# Altium project MiniPC MB GOST.PrjPcb (part 25 of 31)
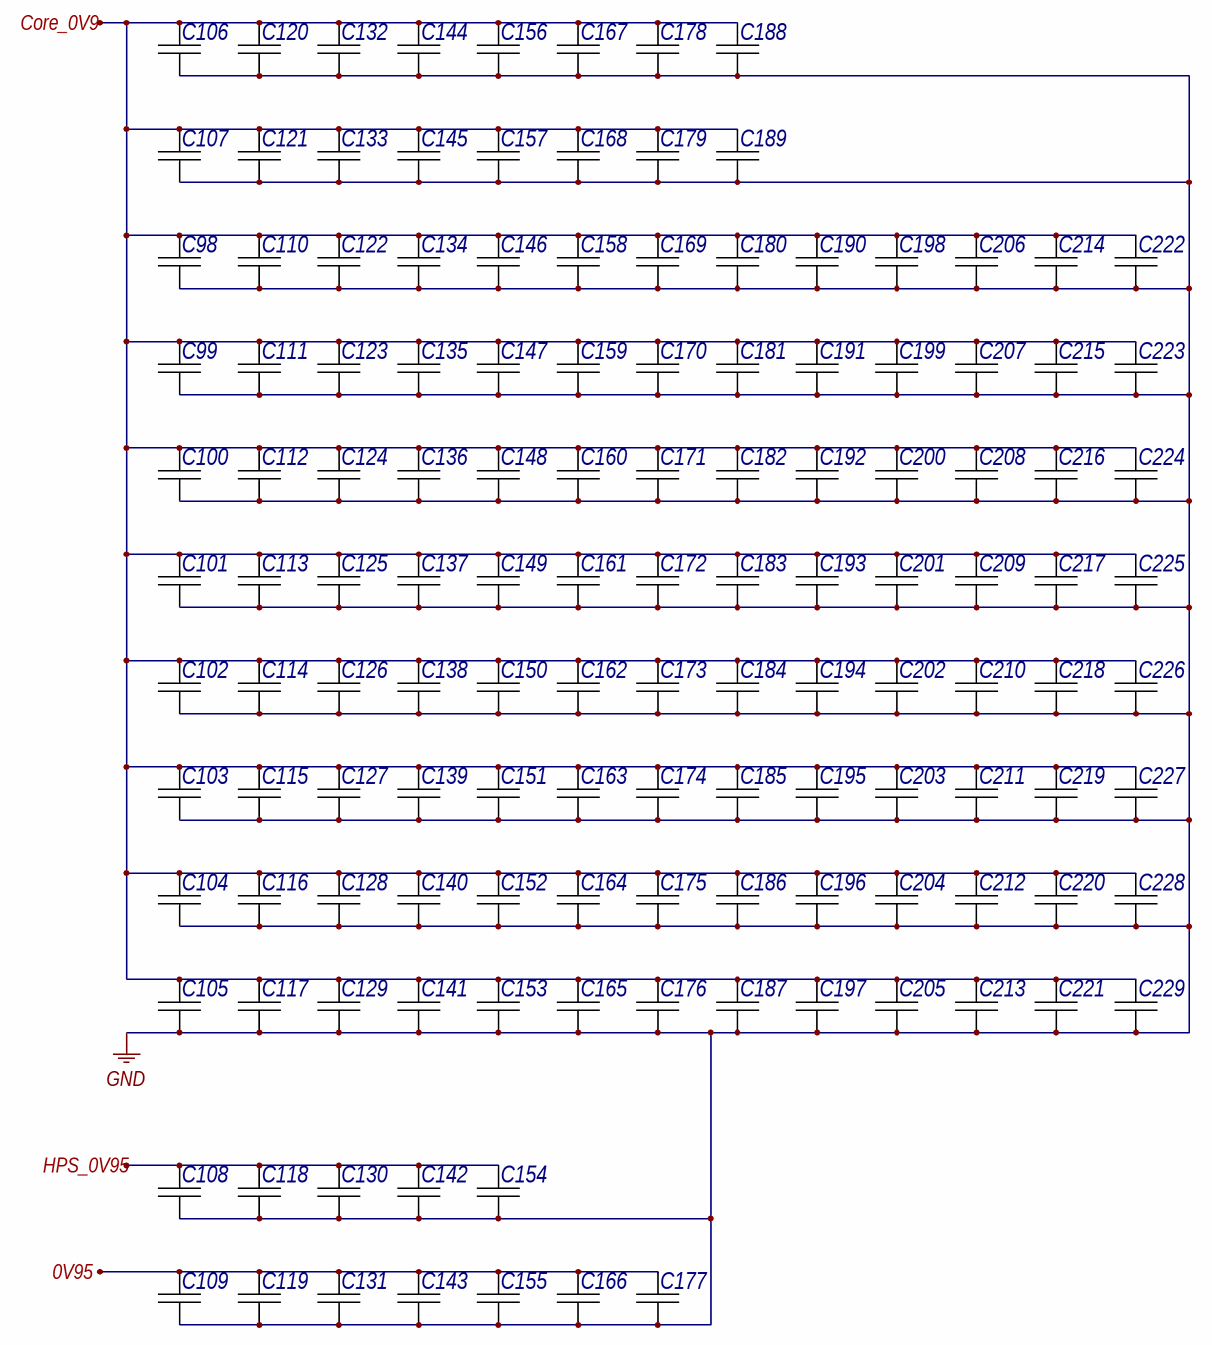
[diagram p52: Core Supply Filter.SchDoc]

## Sheet Core Supply Filter.SchDoc (continued)

### Library data of the parts (continued)
C144 = E14: Chip Capacitor, 100 uF, +/- 20%, 6.3 V, -55 to 85 degC, 1206 (3216 Metric), RoHS, Tape and Reel; Тип элемента: Конденсатор; Capacitance: 100 uF; Case\/Package: 1206; Type (Capacitors): X5R; Voltage Rating: 6.3 V; Old_des: C135; New_des: C136; UID: E14; Component Kind: Standard; Case Code (Imperial): 1206; Case Code (Metric): 3216; ComponentLink1Description: Manufacturer URL; ComponentLink1URL: http://www.murata.com/; ComponentLink2Description: Datasheet; ComponentLink2URL: http://psearch.en.murata.com/capacitor/product/GRM31CR60J107ME39%23.pdf; DatasheetVersion: 09/2016; Length: 3.2 mm; Max Operating Temperature: 85 degC; Min Operating Temperature: -55 degC; Mounting Technology: Surface Mount; Package Quantity: 2000; PackageDescription: 2-Pin Surface Mount Device, Body 3.2 x 1.6 mm; Packaging: Tape and Reel; PartNumber: GRM31CR60J107ME39L; RoHSCompliant: true; Tolerance: 20%; Width: 1.6 mm; Height: 1.6 mm; Mount: Surface Mount; PackageReference: 1206; Pins: 2; Radiation Hardening: No; REACH SVHC: No SVHC; Voltage Rating (DC): 6.3 V
C145 = E14: Chip Capacitor, 100 uF, +/- 20%, 6.3 V, -55 to 85 degC, 1206 (3216 Metric), RoHS, Tape and Reel; Тип элемента: Конденсатор; Capacitance: 100 uF; Case\/Package: 1206; Type (Capacitors): X5R; Voltage Rating: 6.3 V; Old_des: C148; New_des: C137; UID: E14; Component Kind: Standard; Case Code (Imperial): 1206; Case Code (Metric): 3216; ComponentLink1Description: Manufacturer URL; ComponentLink1URL: http://www.murata.com/; ComponentLink2Description: Datasheet; ComponentLink2URL: http://psearch.en.murata.com/capacitor/product/GRM31CR60J107ME39%23.pdf; DatasheetVersion: 09/2016; Length: 3.2 mm; Max Operating Temperature: 85 degC; Min Operating Temperature: -55 degC; Mounting Technology: Surface Mount; Package Quantity: 2000; PackageDescription: 2-Pin Surface Mount Device, Body 3.2 x 1.6 mm; Packaging: Tape and Reel; PartNumber: GRM31CR60J107ME39L; RoHSCompliant: true; Tolerance: 20%; Width: 1.6 mm; Height: 1.6 mm; Mount: Surface Mount; PackageReference: 1206; Pins: 2; Radiation Hardening: No; REACH SVHC: No SVHC; Voltage Rating (DC): 6.3 V
C146 = E22: Chip Capacitor, 100 nF, +/- 10%, 6.3 V, -55 to 85 degC, 0201 (0603 Metric), RoHS, Tape and Reel; Manufacturer: Basic Passives; Тип элемента: Конденсатор; Capacitance: 100 nF; Case\/Package: 0201; Type (Capacitors): X5R; Voltage Rating: 6.3 V; Voltage Rating (DC): 3 V; Old_des: C192; UID: E22; Component Kind: Standard; Case Code (Imperial): 0201; Case Code (Metric): 0603; ComponentLink1Description: Manufacturer URL; ComponentLink1URL: http://www.murata.com/; ComponentLink2Description: Datasheet; ComponentLink2URL: http://search.murata.co.jp/Ceramy/image/img/A01X/G101/ENG/GRM033R60J104KE19-01.pdf; DatasheetVersion: 03/2016; Length: 0.6 mm; Max Operating Temperature: 85 degC; Min Operating Temperature: -55 degC; Mounting Technology: Surface Mount; Package Quantity: 15000; PackageDescription: 2-Pin Surface Mount Device, Body 0.6 x 0.3 mm; Packaging: Tape and Reel; PartNumber: GRM033R60J104KE19D; RoHSCompliant: true; Tolerance: 10%; Width: 0.3 mm; Height: 0.3 mm; Mount: Surface Mount; PackageReference: 0201; Pins: 2; Radiation Hardening: No; REACH SVHC: No SVHC
C147 = E22: Chip Capacitor, 100 nF, +/- 10%, 6.3 V, -55 to 85 degC, 0201 (0603 Metric), RoHS, Tape and Reel; Manufacturer: Basic Passives; Тип элемента: Конденсатор; Capacitance: 100 nF; Case\/Package: 0201; Type (Capacitors): X5R; Voltage Rating: 6.3 V; Voltage Rating (DC): 3 V; Old_des: C193; UID: E22; Component Kind: Standard; Case Code (Imperial): 0201; Case Code (Metric): 0603; ComponentLink1Description: Manufacturer URL; ComponentLink1URL: http://www.murata.com/; ComponentLink2Description: Datasheet; ComponentLink2URL: http://search.murata.co.jp/Ceramy/image/img/A01X/G101/ENG/GRM033R60J104KE19-01.pdf; DatasheetVersion: 03/2016; Length: 0.6 mm; Max Operating Temperature: 85 degC; Min Operating Temperature: -55 degC; Mounting Technology: Surface Mount; Package Quantity: 15000; PackageDescription: 2-Pin Surface Mount Device, Body 0.6 x 0.3 mm; Packaging: Tape and Reel; PartNumber: GRM033R60J104KE19D; RoHSCompliant: true; Tolerance: 10%; Width: 0.3 mm; Height: 0.3 mm; Mount: Surface Mount; PackageReference: 0201; Pins: 2; Radiation Hardening: No; REACH SVHC: No SVHC
C148 = E22: Chip Capacitor, 100 nF, +/- 10%, 6.3 V, -55 to 85 degC, 0201 (0603 Metric), RoHS, Tape and Reel; Manufacturer: Basic Passives; Тип элемента: Конденсатор; Capacitance: 100 nF; Case\/Package: 0201; Type (Capacitors): X5R; Voltage Rating: 6.3 V; Voltage Rating (DC): 3 V; Old_des: C194; UID: E22; Component Kind: Standard; Case Code (Imperial): 0201; Case Code (Metric): 0603; ComponentLink1Description: Manufacturer URL; ComponentLink1URL: http://www.murata.com/; ComponentLink2Description: Datasheet; ComponentLink2URL: http://search.murata.co.jp/Ceramy/image/img/A01X/G101/ENG/GRM033R60J104KE19-01.pdf; DatasheetVersion: 03/2016; Length: 0.6 mm; Max Operating Temperature: 85 degC; Min Operating Temperature: -55 degC; Mounting Technology: Surface Mount; Package Quantity: 15000; PackageDescription: 2-Pin Surface Mount Device, Body 0.6 x 0.3 mm; Packaging: Tape and Reel; PartNumber: GRM033R60J104KE19D; RoHSCompliant: true; Tolerance: 10%; Width: 0.3 mm; Height: 0.3 mm; Mount: Surface Mount; PackageReference: 0201; Pins: 2; Radiation Hardening: No; REACH SVHC: No SVHC
C149 = E22: Chip Capacitor, 100 nF, +/- 10%, 6.3 V, -55 to 85 degC, 0201 (0603 Metric), RoHS, Tape and Reel; Manufacturer: Basic Passives; Тип элемента: Конденсатор; Capacitance: 100 nF; Case\/Package: 0201; Type (Capacitors): X5R; Voltage Rating: 6.3 V; Voltage Rating (DC): 3 V; Old_des: C195; UID: E22; Component Kind: Standard; Case Code (Imperial): 0201; Case Code (Metric): 0603; ComponentLink1Description: Manufacturer URL; ComponentLink1URL: http://www.murata.com/; ComponentLink2Description: Datasheet; ComponentLink2URL: http://search.murata.co.jp/Ceramy/image/img/A01X/G101/ENG/GRM033R60J104KE19-01.pdf; DatasheetVersion: 03/2016; Length: 0.6 mm; Max Operating Temperature: 85 degC; Min Operating Temperature: -55 degC; Mounting Technology: Surface Mount; Package Quantity: 15000; PackageDescription: 2-Pin Surface Mount Device, Body 0.6 x 0.3 mm; Packaging: Tape and Reel; PartNumber: GRM033R60J104KE19D; RoHSCompliant: true; Tolerance: 10%; Width: 0.3 mm; Height: 0.3 mm; Mount: Surface Mount; PackageReference: 0201; Pins: 2; Radiation Hardening: No; REACH SVHC: No SVHC
C150 = E22: Chip Capacitor, 100 nF, +/- 10%, 6.3 V, -55 to 85 degC, 0201 (0603 Metric), RoHS, Tape and Reel; Manufacturer: Basic Passives; Тип элемента: Конденсатор; Capacitance: 100 nF; Case\/Package: 0201; Type (Capacitors): X5R; Voltage Rating: 6.3 V; Voltage Rating (DC): 3 V; Old_des: C196; UID: E22; Component Kind: Standard; Case Code (Imperial): 0201; Case Code (Metric): 0603; ComponentLink1Description: Manufacturer URL; ComponentLink1URL: http://www.murata.com/; ComponentLink2Description: Datasheet; ComponentLink2URL: http://search.murata.co.jp/Ceramy/image/img/A01X/G101/ENG/GRM033R60J104KE19-01.pdf; DatasheetVersion: 03/2016; Length: 0.6 mm; Max Operating Temperature: 85 degC; Min Operating Temperature: -55 degC; Mounting Technology: Surface Mount; Package Quantity: 15000; PackageDescription: 2-Pin Surface Mount Device, Body 0.6 x 0.3 mm; Packaging: Tape and Reel; PartNumber: GRM033R60J104KE19D; RoHSCompliant: true; Tolerance: 10%; Width: 0.3 mm; Height: 0.3 mm; Mount: Surface Mount; PackageReference: 0201; Pins: 2; Radiation Hardening: No; REACH SVHC: No SVHC
C151 = E22: Chip Capacitor, 100 nF, +/- 10%, 6.3 V, -55 to 85 degC, 0201 (0603 Metric), RoHS, Tape and Reel; Manufacturer: Basic Passives; Тип элемента: Конденсатор; Capacitance: 100 nF; Case\/Package: 0201; Type (Capacitors): X5R; Voltage Rating: 6.3 V; Voltage Rating (DC): 3 V; Old_des: C197; UID: E22; Component Kind: Standard; Case Code (Imperial): 0201; Case Code (Metric): 0603; ComponentLink1Description: Manufacturer URL; ComponentLink1URL: http://www.murata.com/; ComponentLink2Description: Datasheet; ComponentLink2URL: http://search.murata.co.jp/Ceramy/image/img/A01X/G101/ENG/GRM033R60J104KE19-01.pdf; DatasheetVersion: 03/2016; Length: 0.6 mm; Max Operating Temperature: 85 degC; Min Operating Temperature: -55 degC; Mounting Technology: Surface Mount; Package Quantity: 15000; PackageDescription: 2-Pin Surface Mount Device, Body 0.6 x 0.3 mm; Packaging: Tape and Reel; PartNumber: GRM033R60J104KE19D; RoHSCompliant: true; Tolerance: 10%; Width: 0.3 mm; Height: 0.3 mm; Mount: Surface Mount; PackageReference: 0201; Pins: 2; Radiation Hardening: No; REACH SVHC: No SVHC
C152 = E22: Chip Capacitor, 100 nF, +/- 10%, 6.3 V, -55 to 85 degC, 0201 (0603 Metric), RoHS, Tape and Reel; Manufacturer: Basic Passives; Тип элемента: Конденсатор; Capacitance: 100 nF; Case\/Package: 0201; Type (Capacitors): X5R; Voltage Rating: 6.3 V; Voltage Rating (DC): 3 V; Old_des: C198; UID: E22; Component Kind: Standard; Case Code (Imperial): 0201; Case Code (Metric): 0603; ComponentLink1Description: Manufacturer URL; ComponentLink1URL: http://www.murata.com/; ComponentLink2Description: Datasheet; ComponentLink2URL: http://search.murata.co.jp/Ceramy/image/img/A01X/G101/ENG/GRM033R60J104KE19-01.pdf; DatasheetVersion: 03/2016; Length: 0.6 mm; Max Operating Temperature: 85 degC; Min Operating Temperature: -55 degC; Mounting Technology: Surface Mount; Package Quantity: 15000; PackageDescription: 2-Pin Surface Mount Device, Body 0.6 x 0.3 mm; Packaging: Tape and Reel; PartNumber: GRM033R60J104KE19D; RoHSCompliant: true; Tolerance: 10%; Width: 0.3 mm; Height: 0.3 mm; Mount: Surface Mount; PackageReference: 0201; Pins: 2; Radiation Hardening: No; REACH SVHC: No SVHC
C153 = E22: Chip Capacitor, 100 nF, +/- 10%, 6.3 V, -55 to 85 degC, 0201 (0603 Metric), RoHS, Tape and Reel; Manufacturer: Basic Passives; Тип элемента: Конденсатор; Capacitance: 100 nF; Case\/Package: 0201; Type (Capacitors): X5R; Voltage Rating: 6.3 V; Voltage Rating (DC): 3 V; Old_des: C199; UID: E22; Component Kind: Standard; Case Code (Imperial): 0201; Case Code (Metric): 0603; ComponentLink1Description: Manufacturer URL; ComponentLink1URL: http://www.murata.com/; ComponentLink2Description: Datasheet; ComponentLink2URL: http://search.murata.co.jp/Ceramy/image/img/A01X/G101/ENG/GRM033R60J104KE19-01.pdf; DatasheetVersion: 03/2016; Length: 0.6 mm; Max Operating Temperature: 85 degC; Min Operating Temperature: -55 degC; Mounting Technology: Surface Mount; Package Quantity: 15000; PackageDescription: 2-Pin Surface Mount Device, Body 0.6 x 0.3 mm; Packaging: Tape and Reel; PartNumber: GRM033R60J104KE19D; RoHSCompliant: true; Tolerance: 10%; Width: 0.3 mm; Height: 0.3 mm; Mount: Surface Mount; PackageReference: 0201; Pins: 2; Radiation Hardening: No; REACH SVHC: No SVHC
C154 = E22: Chip Capacitor, 100 nF, +/- 10%, 6.3 V, -55 to 85 degC, 0201 (0603 Metric), RoHS, Tape and Reel; Manufacturer: Basic Passives; Тип элемента: Конденсатор; Capacitance: 100 nF; Case\/Package: 0201; Type (Capacitors): X5R; Voltage Rating: 6.3 V; Voltage Rating (DC): 3 V; Old_des: C146; UID: E22; Component Kind: Standard; Case Code (Imperial): 0201; Case Code (Metric): 0603; ComponentLink1Description: Manufacturer URL; ComponentLink1URL: http://www.murata.com/; ComponentLink2Description: Datasheet; ComponentLink2URL: http://search.murata.co.jp/Ceramy/image/img/A01X/G101/ENG/GRM033R60J104KE19-01.pdf; DatasheetVersion: 03/2016; Length: 0.6 mm; Max Operating Temperature: 85 degC; Min Operating Temperature: -55 degC; Mounting Technology: Surface Mount; Package Quantity: 15000; PackageDescription: 2-Pin Surface Mount Device, Body 0.6 x 0.3 mm; Packaging: Tape and Reel; PartNumber: GRM033R60J104KE19D; RoHSCompliant: true; Tolerance: 10%; Width: 0.3 mm; Height: 0.3 mm; Mount: Surface Mount; PackageReference: 0201; Pins: 2; Radiation Hardening: No; REACH SVHC: No SVHC
C155 = E22: Chip Capacitor, 100 nF, +/- 10%, 6.3 V, -55 to 85 degC, 0201 (0603 Metric), RoHS, Tape and Reel; Manufacturer: Basic Passives; Тип элемента: Конденсатор; Capacitance: 100 nF; Case\/Package: 0201; Type (Capacitors): X5R; Voltage Rating: 6.3 V; Voltage Rating (DC): 3 V; Old_des: C165; UID: E22; Component Kind: Standard; Case Code (Imperial): 0201; Case Code (Metric): 0603; ComponentLink1Description: Manufacturer URL; ComponentLink1URL: http://www.murata.com/; ComponentLink2Description: Datasheet; ComponentLink2URL: http://search.murata.co.jp/Ceramy/image/img/A01X/G101/ENG/GRM033R60J104KE19-01.pdf; DatasheetVersion: 03/2016; Length: 0.6 mm; Max Operating Temperature: 85 degC; Min Operating Temperature: -55 degC; Mounting Technology: Surface Mount; Package Quantity: 15000; PackageDescription: 2-Pin Surface Mount Device, Body 0.6 x 0.3 mm; Packaging: Tape and Reel; PartNumber: GRM033R60J104KE19D; RoHSCompliant: true; Tolerance: 10%; Width: 0.3 mm; Height: 0.3 mm; Mount: Surface Mount; PackageReference: 0201; Pins: 2; Radiation Hardening: No; REACH SVHC: No SVHC
C156 = E14: Chip Capacitor, 100 uF, +/- 20%, 6.3 V, -55 to 85 degC, 1206 (3216 Metric), RoHS, Tape and Reel; Тип элемента: Конденсатор; Capacitance: 100 uF; Case\/Package: 1206; Type (Capacitors): X5R; Voltage Rating: 6.3 V; Old_des: C136; New_des: C148; UID: E14; Component Kind: Standard; Case Code (Imperial): 1206; Case Code (Metric): 3216; ComponentLink1Description: Manufacturer URL; ComponentLink1URL: http://www.murata.com/; ComponentLink2Description: Datasheet; ComponentLink2URL: http://psearch.en.murata.com/capacitor/product/GRM31CR60J107ME39%23.pdf; DatasheetVersion: 09/2016; Length: 3.2 mm; Max Operating Temperature: 85 degC; Min Operating Temperature: -55 degC; Mounting Technology: Surface Mount; Package Quantity: 2000; PackageDescription: 2-Pin Surface Mount Device, Body 3.2 x 1.6 mm; Packaging: Tape and Reel; PartNumber: GRM31CR60J107ME39L; RoHSCompliant: true; Tolerance: 20%; Width: 1.6 mm; Height: 1.6 mm; Mount: Surface Mount; PackageReference: 1206; Pins: 2; Radiation Hardening: No; REACH SVHC: No SVHC; Voltage Rating (DC): 6.3 V
C157 = E14: Chip Capacitor, 100 uF, +/- 20%, 6.3 V, -55 to 85 degC, 1206 (3216 Metric), RoHS, Tape and Reel; Тип элемента: Конденсатор; Capacitance: 100 uF; Case\/Package: 1206; Type (Capacitors): X5R; Voltage Rating: 6.3 V; Old_des: C149; UID: E14; Component Kind: Standard; Case Code (Imperial): 1206; Case Code (Metric): 3216; ComponentLink1Description: Manufacturer URL; ComponentLink1URL: http://www.murata.com/; ComponentLink2Description: Datasheet; ComponentLink2URL: http://psearch.en.murata.com/capacitor/product/GRM31CR60J107ME39%23.pdf; DatasheetVersion: 09/2016; Length: 3.2 mm; Max Operating Temperature: 85 degC; Min Operating Temperature: -55 degC; Mounting Technology: Surface Mount; Package Quantity: 2000; PackageDescription: 2-Pin Surface Mount Device, Body 3.2 x 1.6 mm; Packaging: Tape and Reel; PartNumber: GRM31CR60J107ME39L; RoHSCompliant: true; Tolerance: 20%; Width: 1.6 mm; Height: 1.6 mm; Mount: Surface Mount; PackageReference: 1206; Pins: 2; Radiation Hardening: No; REACH SVHC: No SVHC; Voltage Rating (DC): 6.3 V; New_des: C149
C158 = E22: Chip Capacitor, 100 nF, +/- 10%, 6.3 V, -55 to 85 degC, 0201 (0603 Metric), RoHS, Tape and Reel; Manufacturer: Basic Passives; Тип элемента: Конденсатор; Capacitance: 100 nF; Case\/Package: 0201; Type (Capacitors): X5R; Voltage Rating: 6.3 V; Voltage Rating (DC): 3 V; Old_des: C200; UID: E22; Component Kind: Standard; Case Code (Imperial): 0201; Case Code (Metric): 0603; ComponentLink1Description: Manufacturer URL; ComponentLink1URL: http://www.murata.com/; ComponentLink2Description: Datasheet; ComponentLink2URL: http://search.murata.co.jp/Ceramy/image/img/A01X/G101/ENG/GRM033R60J104KE19-01.pdf; DatasheetVersion: 03/2016; Length: 0.6 mm; Max Operating Temperature: 85 degC; Min Operating Temperature: -55 degC; Mounting Technology: Surface Mount; Package Quantity: 15000; PackageDescription: 2-Pin Surface Mount Device, Body 0.6 x 0.3 mm; Packaging: Tape and Reel; PartNumber: GRM033R60J104KE19D; RoHSCompliant: true; Tolerance: 10%; Width: 0.3 mm; Height: 0.3 mm; Mount: Surface Mount; PackageReference: 0201; Pins: 2; Radiation Hardening: No; REACH SVHC: No SVHC
C159 = E22: Chip Capacitor, 100 nF, +/- 10%, 6.3 V, -55 to 85 degC, 0201 (0603 Metric), RoHS, Tape and Reel; Manufacturer: Basic Passives; Тип элемента: Конденсатор; Capacitance: 100 nF; Case\/Package: 0201; Type (Capacitors): X5R; Voltage Rating: 6.3 V; Voltage Rating (DC): 3 V; Old_des: C201; UID: E22; Component Kind: Standard; Case Code (Imperial): 0201; Case Code (Metric): 0603; ComponentLink1Description: Manufacturer URL; ComponentLink1URL: http://www.murata.com/; ComponentLink2Description: Datasheet; ComponentLink2URL: http://search.murata.co.jp/Ceramy/image/img/A01X/G101/ENG/GRM033R60J104KE19-01.pdf; DatasheetVersion: 03/2016; Length: 0.6 mm; Max Operating Temperature: 85 degC; Min Operating Temperature: -55 degC; Mounting Technology: Surface Mount; Package Quantity: 15000; PackageDescription: 2-Pin Surface Mount Device, Body 0.6 x 0.3 mm; Packaging: Tape and Reel; PartNumber: GRM033R60J104KE19D; RoHSCompliant: true; Tolerance: 10%; Width: 0.3 mm; Height: 0.3 mm; Mount: Surface Mount; PackageReference: 0201; Pins: 2; Radiation Hardening: No; REACH SVHC: No SVHC
C160 = E22: Chip Capacitor, 100 nF, +/- 10%, 6.3 V, -55 to 85 degC, 0201 (0603 Metric), RoHS, Tape and Reel; Manufacturer: Basic Passives; Тип элемента: Конденсатор; Capacitance: 100 nF; Case\/Package: 0201; Type (Capacitors): X5R; Voltage Rating: 6.3 V; Voltage Rating (DC): 3 V; Old_des: C202; UID: E22; Component Kind: Standard; Case Code (Imperial): 0201; Case Code (Metric): 0603; ComponentLink1Description: Manufacturer URL; ComponentLink1URL: http://www.murata.com/; ComponentLink2Description: Datasheet; ComponentLink2URL: http://search.murata.co.jp/Ceramy/image/img/A01X/G101/ENG/GRM033R60J104KE19-01.pdf; DatasheetVersion: 03/2016; Length: 0.6 mm; Max Operating Temperature: 85 degC; Min Operating Temperature: -55 degC; Mounting Technology: Surface Mount; Package Quantity: 15000; PackageDescription: 2-Pin Surface Mount Device, Body 0.6 x 0.3 mm; Packaging: Tape and Reel; PartNumber: GRM033R60J104KE19D; RoHSCompliant: true; Tolerance: 10%; Width: 0.3 mm; Height: 0.3 mm; Mount: Surface Mount; PackageReference: 0201; Pins: 2; Radiation Hardening: No; REACH SVHC: No SVHC
C161 = E22: Chip Capacitor, 100 nF, +/- 10%, 6.3 V, -55 to 85 degC, 0201 (0603 Metric), RoHS, Tape and Reel; Manufacturer: Basic Passives; Тип элемента: Конденсатор; Capacitance: 100 nF; Case\/Package: 0201; Type (Capacitors): X5R; Voltage Rating: 6.3 V; Voltage Rating (DC): 3 V; Old_des: C203; UID: E22; Component Kind: Standard; Case Code (Imperial): 0201; Case Code (Metric): 0603; ComponentLink1Description: Manufacturer URL; ComponentLink1URL: http://www.murata.com/; ComponentLink2Description: Datasheet; ComponentLink2URL: http://search.murata.co.jp/Ceramy/image/img/A01X/G101/ENG/GRM033R60J104KE19-01.pdf; DatasheetVersion: 03/2016; Length: 0.6 mm; Max Operating Temperature: 85 degC; Min Operating Temperature: -55 degC; Mounting Technology: Surface Mount; Package Quantity: 15000; PackageDescription: 2-Pin Surface Mount Device, Body 0.6 x 0.3 mm; Packaging: Tape and Reel; PartNumber: GRM033R60J104KE19D; RoHSCompliant: true; Tolerance: 10%; Width: 0.3 mm; Height: 0.3 mm; Mount: Surface Mount; PackageReference: 0201; Pins: 2; Radiation Hardening: No; REACH SVHC: No SVHC
C162 = E22: Chip Capacitor, 100 nF, +/- 10%, 6.3 V, -55 to 85 degC, 0201 (0603 Metric), RoHS, Tape and Reel; Manufacturer: Basic Passives; Тип элемента: Конденсатор; Capacitance: 100 nF; Case\/Package: 0201; Type (Capacitors): X5R; Voltage Rating: 6.3 V; Voltage Rating (DC): 3 V; Old_des: C204; UID: E22; Component Kind: Standard; Case Code (Imperial): 0201; Case Code (Metric): 0603; ComponentLink1Description: Manufacturer URL; ComponentLink1URL: http://www.murata.com/; ComponentLink2Description: Datasheet; ComponentLink2URL: http://search.murata.co.jp/Ceramy/image/img/A01X/G101/ENG/GRM033R60J104KE19-01.pdf; DatasheetVersion: 03/2016; Length: 0.6 mm; Max Operating Temperature: 85 degC; Min Operating Temperature: -55 degC; Mounting Technology: Surface Mount; Package Quantity: 15000; PackageDescription: 2-Pin Surface Mount Device, Body 0.6 x 0.3 mm; Packaging: Tape and Reel; PartNumber: GRM033R60J104KE19D; RoHSCompliant: true; Tolerance: 10%; Width: 0.3 mm; Height: 0.3 mm; Mount: Surface Mount; PackageReference: 0201; Pins: 2; Radiation Hardening: No; REACH SVHC: No SVHC
C163 = E22: Chip Capacitor, 100 nF, +/- 10%, 6.3 V, -55 to 85 degC, 0201 (0603 Metric), RoHS, Tape and Reel; Manufacturer: Basic Passives; Тип элемента: Конденсатор; Capacitance: 100 nF; Case\/Package: 0201; Type (Capacitors): X5R; Voltage Rating: 6.3 V; Voltage Rating (DC): 3 V; Old_des: C205; UID: E22; Component Kind: Standard; Case Code (Imperial): 0201; Case Code (Metric): 0603; ComponentLink1Description: Manufacturer URL; ComponentLink1URL: http://www.murata.com/; ComponentLink2Description: Datasheet; ComponentLink2URL: http://search.murata.co.jp/Ceramy/image/img/A01X/G101/ENG/GRM033R60J104KE19-01.pdf; DatasheetVersion: 03/2016; Length: 0.6 mm; Max Operating Temperature: 85 degC; Min Operating Temperature: -55 degC; Mounting Technology: Surface Mount; Package Quantity: 15000; PackageDescription: 2-Pin Surface Mount Device, Body 0.6 x 0.3 mm; Packaging: Tape and Reel; PartNumber: GRM033R60J104KE19D; RoHSCompliant: true; Tolerance: 10%; Width: 0.3 mm; Height: 0.3 mm; Mount: Surface Mount; PackageReference: 0201; Pins: 2; Radiation Hardening: No; REACH SVHC: No SVHC
C164 = E22: Chip Capacitor, 100 nF, +/- 10%, 6.3 V, -55 to 85 degC, 0201 (0603 Metric), RoHS, Tape and Reel; Manufacturer: Basic Passives; Тип элемента: Конденсатор; Capacitance: 100 nF; Case\/Package: 0201; Type (Capacitors): X5R; Voltage Rating: 6.3 V; Voltage Rating (DC): 3 V; Old_des: C206; UID: E22; Component Kind: Standard; Case Code (Imperial): 0201; Case Code (Metric): 0603; ComponentLink1Description: Manufacturer URL; ComponentLink1URL: http://www.murata.com/; ComponentLink2Description: Datasheet; ComponentLink2URL: http://search.murata.co.jp/Ceramy/image/img/A01X/G101/ENG/GRM033R60J104KE19-01.pdf; DatasheetVersion: 03/2016; Length: 0.6 mm; Max Operating Temperature: 85 degC; Min Operating Temperature: -55 degC; Mounting Technology: Surface Mount; Package Quantity: 15000; PackageDescription: 2-Pin Surface Mount Device, Body 0.6 x 0.3 mm; Packaging: Tape and Reel; PartNumber: GRM033R60J104KE19D; RoHSCompliant: true; Tolerance: 10%; Width: 0.3 mm; Height: 0.3 mm; Mount: Surface Mount; PackageReference: 0201; Pins: 2; Radiation Hardening: No; REACH SVHC: No SVHC
C165 = E22: Chip Capacitor, 100 nF, +/- 10%, 6.3 V, -55 to 85 degC, 0201 (0603 Metric), RoHS, Tape and Reel; Manufacturer: Basic Passives; Тип элемента: Конденсатор; Capacitance: 100 nF; Case\/Package: 0201; Type (Capacitors): X5R; Voltage Rating: 6.3 V; Voltage Rating (DC): 3 V; Old_des: C207; UID: E22; Component Kind: Standard; Case Code (Imperial): 0201; Case Code (Metric): 0603; ComponentLink1Description: Manufacturer URL; ComponentLink1URL: http://www.murata.com/; ComponentLink2Description: Datasheet; ComponentLink2URL: http://search.murata.co.jp/Ceramy/image/img/A01X/G101/ENG/GRM033R60J104KE19-01.pdf; DatasheetVersion: 03/2016; Length: 0.6 mm; Max Operating Temperature: 85 degC; Min Operating Temperature: -55 degC; Mounting Technology: Surface Mount; Package Quantity: 15000; PackageDescription: 2-Pin Surface Mount Device, Body 0.6 x 0.3 mm; Packaging: Tape and Reel; PartNumber: GRM033R60J104KE19D; RoHSCompliant: true; Tolerance: 10%; Width: 0.3 mm; Height: 0.3 mm; Mount: Surface Mount; PackageReference: 0201; Pins: 2; Radiation Hardening: No; REACH SVHC: No SVHC
C166 = E22: Chip Capacitor, 100 nF, +/- 10%, 6.3 V, -55 to 85 degC, 0201 (0603 Metric), RoHS, Tape and Reel; Manufacturer: Basic Passives; Тип элемента: Конденсатор; Capacitance: 100 nF; Case\/Package: 0201; Type (Capacitors): X5R; Voltage Rating: 6.3 V; Voltage Rating (DC): 3 V; Old_des: C166; UID: E22; Component Kind: Standard; Case Code (Imperial): 0201; Case Code (Metric): 0603; ComponentLink1Description: Manufacturer URL; ComponentLink1URL: http://www.murata.com/; ComponentLink2Description: Datasheet; ComponentLink2URL: http://search.murata.co.jp/Ceramy/image/img/A01X/G101/ENG/GRM033R60J104KE19-01.pdf; DatasheetVersion: 03/2016; Length: 0.6 mm; Max Operating Temperature: 85 degC; Min Operating Temperature: -55 degC; Mounting Technology: Surface Mount; Package Quantity: 15000; PackageDescription: 2-Pin Surface Mount Device, Body 0.6 x 0.3 mm; Packaging: Tape and Reel; PartNumber: GRM033R60J104KE19D; RoHSCompliant: true; Tolerance: 10%; Width: 0.3 mm; Height: 0.3 mm; Mount: Surface Mount; PackageReference: 0201; Pins: 2; Radiation Hardening: No; REACH SVHC: No SVHC
C167 = E14: Chip Capacitor, 100 uF, +/- 20%, 6.3 V, -55 to 85 degC, 1206 (3216 Metric), RoHS, Tape and Reel; Тип элемента: Конденсатор; Capacitance: 100 uF; Case\/Package: 1206; Type (Capacitors): X5R; Voltage Rating: 6.3 V; Old_des: C137; New_des: C159; UID: E14; Component Kind: Standard; Case Code (Imperial): 1206; Case Code (Metric): 3216; ComponentLink1Description: Manufacturer URL; ComponentLink1URL: http://www.murata.com/; ComponentLink2Description: Datasheet; ComponentLink2URL: http://psearch.en.murata.com/capacitor/product/GRM31CR60J107ME39%23.pdf; DatasheetVersion: 09/2016; Length: 3.2 mm; Max Operating Temperature: 85 degC; Min Operating Temperature: -55 degC; Mounting Technology: Surface Mount; Package Quantity: 2000; PackageDescription: 2-Pin Surface Mount Device, Body 3.2 x 1.6 mm; Packaging: Tape and Reel; PartNumber: GRM31CR60J107ME39L; RoHSCompliant: true; Tolerance: 20%; Width: 1.6 mm; Height: 1.6 mm; Mount: Surface Mount; PackageReference: 1206; Pins: 2; Radiation Hardening: No; REACH SVHC: No SVHC; Voltage Rating (DC): 6.3 V
C168 = E14: Chip Capacitor, 100 uF, +/- 20%, 6.3 V, -55 to 85 degC, 1206 (3216 Metric), RoHS, Tape and Reel; Тип элемента: Конденсатор; Capacitance: 100 uF; Case\/Package: 1206; Type (Capacitors): X5R; Voltage Rating: 6.3 V; Old_des: C150; New_des: C160; UID: E14; Component Kind: Standard; Case Code (Imperial): 1206; Case Code (Metric): 3216; ComponentLink1Description: Manufacturer URL; ComponentLink1URL: http://www.murata.com/; ComponentLink2Description: Datasheet; ComponentLink2URL: http://psearch.en.murata.com/capacitor/product/GRM31CR60J107ME39%23.pdf; DatasheetVersion: 09/2016; Length: 3.2 mm; Max Operating Temperature: 85 degC; Min Operating Temperature: -55 degC; Mounting Technology: Surface Mount; Package Quantity: 2000; PackageDescription: 2-Pin Surface Mount Device, Body 3.2 x 1.6 mm; Packaging: Tape and Reel; PartNumber: GRM31CR60J107ME39L; RoHSCompliant: true; Tolerance: 20%; Width: 1.6 mm; Height: 1.6 mm; Mount: Surface Mount; PackageReference: 1206; Pins: 2; Radiation Hardening: No; REACH SVHC: No SVHC; Voltage Rating (DC): 6.3 V
C169 = E22: Chip Capacitor, 100 nF, +/- 10%, 6.3 V, -55 to 85 degC, 0201 (0603 Metric), RoHS, Tape and Reel; Manufacturer: Basic Passives; Тип элемента: Конденсатор; Capacitance: 100 nF; Case\/Package: 0201; Type (Capacitors): X5R; Voltage Rating: 6.3 V; Voltage Rating (DC): 3 V; Old_des: C208; UID: E22; Component Kind: Standard; Case Code (Imperial): 0201; Case Code (Metric): 0603; ComponentLink1Description: Manufacturer URL; ComponentLink1URL: http://www.murata.com/; ComponentLink2Description: Datasheet; ComponentLink2URL: http://search.murata.co.jp/Ceramy/image/img/A01X/G101/ENG/GRM033R60J104KE19-01.pdf; DatasheetVersion: 03/2016; Length: 0.6 mm; Max Operating Temperature: 85 degC; Min Operating Temperature: -55 degC; Mounting Technology: Surface Mount; Package Quantity: 15000; PackageDescription: 2-Pin Surface Mount Device, Body 0.6 x 0.3 mm; Packaging: Tape and Reel; PartNumber: GRM033R60J104KE19D; RoHSCompliant: true; Tolerance: 10%; Width: 0.3 mm; Height: 0.3 mm; Mount: Surface Mount; PackageReference: 0201; Pins: 2; Radiation Hardening: No; REACH SVHC: No SVHC
C170 = E22: Chip Capacitor, 100 nF, +/- 10%, 6.3 V, -55 to 85 degC, 0201 (0603 Metric), RoHS, Tape and Reel; Manufacturer: Basic Passives; Тип элемента: Конденсатор; Capacitance: 100 nF; Case\/Package: 0201; Type (Capacitors): X5R; Voltage Rating: 6.3 V; Voltage Rating (DC): 3 V; Old_des: C209; UID: E22; Component Kind: Standard; Case Code (Imperial): 0201; Case Code (Metric): 0603; ComponentLink1Description: Manufacturer URL; ComponentLink1URL: http://www.murata.com/; ComponentLink2Description: Datasheet; ComponentLink2URL: http://search.murata.co.jp/Ceramy/image/img/A01X/G101/ENG/GRM033R60J104KE19-01.pdf; DatasheetVersion: 03/2016; Length: 0.6 mm; Max Operating Temperature: 85 degC; Min Operating Temperature: -55 degC; Mounting Technology: Surface Mount; Package Quantity: 15000; PackageDescription: 2-Pin Surface Mount Device, Body 0.6 x 0.3 mm; Packaging: Tape and Reel; PartNumber: GRM033R60J104KE19D; RoHSCompliant: true; Tolerance: 10%; Width: 0.3 mm; Height: 0.3 mm; Mount: Surface Mount; PackageReference: 0201; Pins: 2; Radiation Hardening: No; REACH SVHC: No SVHC
C171 = E22: Chip Capacitor, 100 nF, +/- 10%, 6.3 V, -55 to 85 degC, 0201 (0603 Metric), RoHS, Tape and Reel; Manufacturer: Basic Passives; Тип элемента: Конденсатор; Capacitance: 100 nF; Case\/Package: 0201; Type (Capacitors): X5R; Voltage Rating: 6.3 V; Voltage Rating (DC): 3 V; Old_des: C210; UID: E22; Component Kind: Standard; Case Code (Imperial): 0201; Case Code (Metric): 0603; ComponentLink1Description: Manufacturer URL; ComponentLink1URL: http://www.murata.com/; ComponentLink2Description: Datasheet; ComponentLink2URL: http://search.murata.co.jp/Ceramy/image/img/A01X/G101/ENG/GRM033R60J104KE19-01.pdf; DatasheetVersion: 03/2016; Length: 0.6 mm; Max Operating Temperature: 85 degC; Min Operating Temperature: -55 degC; Mounting Technology: Surface Mount; Package Quantity: 15000; PackageDescription: 2-Pin Surface Mount Device, Body 0.6 x 0.3 mm; Packaging: Tape and Reel; PartNumber: GRM033R60J104KE19D; RoHSCompliant: true; Tolerance: 10%; Width: 0.3 mm; Height: 0.3 mm; Mount: Surface Mount; PackageReference: 0201; Pins: 2; Radiation Hardening: No; REACH SVHC: No SVHC
C172 = E22: Chip Capacitor, 100 nF, +/- 10%, 6.3 V, -55 to 85 degC, 0201 (0603 Metric), RoHS, Tape and Reel; Manufacturer: Basic Passives; Тип элемента: Конденсатор; Capacitance: 100 nF; Case\/Package: 0201; Type (Capacitors): X5R; Voltage Rating: 6.3 V; Voltage Rating (DC): 3 V; Old_des: C211; UID: E22; Component Kind: Standard; Case Code (Imperial): 0201; Case Code (Metric): 0603; ComponentLink1Description: Manufacturer URL; ComponentLink1URL: http://www.murata.com/; ComponentLink2Description: Datasheet; ComponentLink2URL: http://search.murata.co.jp/Ceramy/image/img/A01X/G101/ENG/GRM033R60J104KE19-01.pdf; DatasheetVersion: 03/2016; Length: 0.6 mm; Max Operating Temperature: 85 degC; Min Operating Temperature: -55 degC; Mounting Technology: Surface Mount; Package Quantity: 15000; PackageDescription: 2-Pin Surface Mount Device, Body 0.6 x 0.3 mm; Packaging: Tape and Reel; PartNumber: GRM033R60J104KE19D; RoHSCompliant: true; Tolerance: 10%; Width: 0.3 mm; Height: 0.3 mm; Mount: Surface Mount; PackageReference: 0201; Pins: 2; Radiation Hardening: No; REACH SVHC: No SVHC
C173 = E22: Chip Capacitor, 100 nF, +/- 10%, 6.3 V, -55 to 85 degC, 0201 (0603 Metric), RoHS, Tape and Reel; Manufacturer: Basic Passives; Тип элемента: Конденсатор; Capacitance: 100 nF; Case\/Package: 0201; Type (Capacitors): X5R; Voltage Rating: 6.3 V; Voltage Rating (DC): 3 V; Old_des: C212; UID: E22; Component Kind: Standard; Case Code (Imperial): 0201; Case Code (Metric): 0603; ComponentLink1Description: Manufacturer URL; ComponentLink1URL: http://www.murata.com/; ComponentLink2Description: Datasheet; ComponentLink2URL: http://search.murata.co.jp/Ceramy/image/img/A01X/G101/ENG/GRM033R60J104KE19-01.pdf; DatasheetVersion: 03/2016; Length: 0.6 mm; Max Operating Temperature: 85 degC; Min Operating Temperature: -55 degC; Mounting Technology: Surface Mount; Package Quantity: 15000; PackageDescription: 2-Pin Surface Mount Device, Body 0.6 x 0.3 mm; Packaging: Tape and Reel; PartNumber: GRM033R60J104KE19D; RoHSCompliant: true; Tolerance: 10%; Width: 0.3 mm; Height: 0.3 mm; Mount: Surface Mount; PackageReference: 0201; Pins: 2; Radiation Hardening: No; REACH SVHC: No SVHC
C174 = E22: Chip Capacitor, 100 nF, +/- 10%, 6.3 V, -55 to 85 degC, 0201 (0603 Metric), RoHS, Tape and Reel; Manufacturer: Basic Passives; Тип элемента: Конденсатор; Capacitance: 100 nF; Case\/Package: 0201; Type (Capacitors): X5R; Voltage Rating: 6.3 V; Voltage Rating (DC): 3 V; Old_des: C213; UID: E22; Component Kind: Standard; Case Code (Imperial): 0201; Case Code (Metric): 0603; ComponentLink1Description: Manufacturer URL; ComponentLink1URL: http://www.murata.com/; ComponentLink2Description: Datasheet; ComponentLink2URL: http://search.murata.co.jp/Ceramy/image/img/A01X/G101/ENG/GRM033R60J104KE19-01.pdf; DatasheetVersion: 03/2016; Length: 0.6 mm; Max Operating Temperature: 85 degC; Min Operating Temperature: -55 degC; Mounting Technology: Surface Mount; Package Quantity: 15000; PackageDescription: 2-Pin Surface Mount Device, Body 0.6 x 0.3 mm; Packaging: Tape and Reel; PartNumber: GRM033R60J104KE19D; RoHSCompliant: true; Tolerance: 10%; Width: 0.3 mm; Height: 0.3 mm; Mount: Surface Mount; PackageReference: 0201; Pins: 2; Radiation Hardening: No; REACH SVHC: No SVHC
C175 = E22: Chip Capacitor, 100 nF, +/- 10%, 6.3 V, -55 to 85 degC, 0201 (0603 Metric), RoHS, Tape and Reel; Manufacturer: Basic Passives; Тип элемента: Конденсатор; Capacitance: 100 nF; Case\/Package: 0201; Type (Capacitors): X5R; Voltage Rating: 6.3 V; Voltage Rating (DC): 3 V; Old_des: C214; UID: E22; Component Kind: Standard; Case Code (Imperial): 0201; Case Code (Metric): 0603; ComponentLink1Description: Manufacturer URL; ComponentLink1URL: http://www.murata.com/; ComponentLink2Description: Datasheet; ComponentLink2URL: http://search.murata.co.jp/Ceramy/image/img/A01X/G101/ENG/GRM033R60J104KE19-01.pdf; DatasheetVersion: 03/2016; Length: 0.6 mm; Max Operating Temperature: 85 degC; Min Operating Temperature: -55 degC; Mounting Technology: Surface Mount; Package Quantity: 15000; PackageDescription: 2-Pin Surface Mount Device, Body 0.6 x 0.3 mm; Packaging: Tape and Reel; PartNumber: GRM033R60J104KE19D; RoHSCompliant: true; Tolerance: 10%; Width: 0.3 mm; Height: 0.3 mm; Mount: Surface Mount; PackageReference: 0201; Pins: 2; Radiation Hardening: No; REACH SVHC: No SVHC
C176 = E22: Chip Capacitor, 100 nF, +/- 10%, 6.3 V, -55 to 85 degC, 0201 (0603 Metric), RoHS, Tape and Reel; Manufacturer: Basic Passives; Тип элемента: Конденсатор; Capacitance: 100 nF; Case\/Package: 0201; Type (Capacitors): X5R; Voltage Rating: 6.3 V; Voltage Rating (DC): 3 V; Old_des: C215; UID: E22; Component Kind: Standard; Case Code (Imperial): 0201; Case Code (Metric): 0603; ComponentLink1Description: Manufacturer URL; ComponentLink1URL: http://www.murata.com/; ComponentLink2Description: Datasheet; ComponentLink2URL: http://search.murata.co.jp/Ceramy/image/img/A01X/G101/ENG/GRM033R60J104KE19-01.pdf; DatasheetVersion: 03/2016; Length: 0.6 mm; Max Operating Temperature: 85 degC; Min Operating Temperature: -55 degC; Mounting Technology: Surface Mount; Package Quantity: 15000; PackageDescription: 2-Pin Surface Mount Device, Body 0.6 x 0.3 mm; Packaging: Tape and Reel; PartNumber: GRM033R60J104KE19D; RoHSCompliant: true; Tolerance: 10%; Width: 0.3 mm; Height: 0.3 mm; Mount: Surface Mount; PackageReference: 0201; Pins: 2; Radiation Hardening: No; REACH SVHC: No SVHC
C177 = E22: Chip Capacitor, 100 nF, +/- 10%, 6.3 V, -55 to 85 degC, 0201 (0603 Metric), RoHS, Tape and Reel; Manufacturer: Basic Passives; Тип элемента: Конденсатор; Capacitance: 100 nF; Case\/Package: 0201; Type (Capacitors): X5R; Voltage Rating: 6.3 V; Voltage Rating (DC): 3 V; Old_des: C167; UID: E22; Component Kind: Standard; Case Code (Imperial): 0201; Case Code (Metric): 0603; ComponentLink1Description: Manufacturer URL; ComponentLink1URL: http://www.murata.com/; ComponentLink2Description: Datasheet; ComponentLink2URL: http://search.murata.co.jp/Ceramy/image/img/A01X/G101/ENG/GRM033R60J104KE19-01.pdf; DatasheetVersion: 03/2016; Length: 0.6 mm; Max Operating Temperature: 85 degC; Min Operating Temperature: -55 degC; Mounting Technology: Surface Mount; Package Quantity: 15000; PackageDescription: 2-Pin Surface Mount Device, Body 0.6 x 0.3 mm; Packaging: Tape and Reel; PartNumber: GRM033R60J104KE19D; RoHSCompliant: true; Tolerance: 10%; Width: 0.3 mm; Height: 0.3 mm; Mount: Surface Mount; PackageReference: 0201; Pins: 2; Radiation Hardening: No; REACH SVHC: No SVHC
C178 = E14: Chip Capacitor, 100 uF, +/- 20%, 6.3 V, -55 to 85 degC, 1206 (3216 Metric), RoHS, Tape and Reel; Тип элемента: Конденсатор; Capacitance: 100 uF; Case\/Package: 1206; Type (Capacitors): X5R; Voltage Rating: 6.3 V; Old_des: C138; New_des: C170; UID: E14; Component Kind: Standard; Case Code (Imperial): 1206; Case Code (Metric): 3216; ComponentLink1Description: Manufacturer URL; ComponentLink1URL: http://www.murata.com/; ComponentLink2Description: Datasheet; ComponentLink2URL: http://psearch.en.murata.com/capacitor/product/GRM31CR60J107ME39%23.pdf; DatasheetVersion: 09/2016; Length: 3.2 mm; Max Operating Temperature: 85 degC; Min Operating Temperature: -55 degC; Mounting Technology: Surface Mount; Package Quantity: 2000; PackageDescription: 2-Pin Surface Mount Device, Body 3.2 x 1.6 mm; Packaging: Tape and Reel; PartNumber: GRM31CR60J107ME39L; RoHSCompliant: true; Tolerance: 20%; Width: 1.6 mm; Height: 1.6 mm; Mount: Surface Mount; PackageReference: 1206; Pins: 2; Radiation Hardening: No; REACH SVHC: No SVHC; Voltage Rating (DC): 6.3 V
C179 = E14: Chip Capacitor, 100 uF, +/- 20%, 6.3 V, -55 to 85 degC, 1206 (3216 Metric), RoHS, Tape and Reel; Тип элемента: Конденсатор; Capacitance: 100 uF; Case\/Package: 1206; Type (Capacitors): X5R; Voltage Rating: 6.3 V; Old_des: C151; New_des: C171; UID: E14; Component Kind: Standard; Case Code (Imperial): 1206; Case Code (Metric): 3216; ComponentLink1Description: Manufacturer URL; ComponentLink1URL: http://www.murata.com/; ComponentLink2Description: Datasheet; ComponentLink2URL: http://psearch.en.murata.com/capacitor/product/GRM31CR60J107ME39%23.pdf; DatasheetVersion: 09/2016; Length: 3.2 mm; Max Operating Temperature: 85 degC; Min Operating Temperature: -55 degC; Mounting Technology: Surface Mount; Package Quantity: 2000; PackageDescription: 2-Pin Surface Mount Device, Body 3.2 x 1.6 mm; Packaging: Tape and Reel; PartNumber: GRM31CR60J107ME39L; RoHSCompliant: true; Tolerance: 20%; Width: 1.6 mm; Height: 1.6 mm; Mount: Surface Mount; PackageReference: 1206; Pins: 2; Radiation Hardening: No; REACH SVHC: No SVHC; Voltage Rating (DC): 6.3 V
C180 = E22: Chip Capacitor, 100 nF, +/- 10%, 6.3 V, -55 to 85 degC, 0201 (0603 Metric), RoHS, Tape and Reel; Manufacturer: Basic Passives; Тип элемента: Конденсатор; Capacitance: 100 nF; Case\/Package: 0201; Type (Capacitors): X5R; Voltage Rating: 6.3 V; Voltage Rating (DC): 3 V; Old_des: C216; UID: E22; Component Kind: Standard; Case Code (Imperial): 0201; Case Code (Metric): 0603; ComponentLink1Description: Manufacturer URL; ComponentLink1URL: http://www.murata.com/; ComponentLink2Description: Datasheet; ComponentLink2URL: http://search.murata.co.jp/Ceramy/image/img/A01X/G101/ENG/GRM033R60J104KE19-01.pdf; DatasheetVersion: 03/2016; Length: 0.6 mm; Max Operating Temperature: 85 degC; Min Operating Temperature: -55 degC; Mounting Technology: Surface Mount; Package Quantity: 15000; PackageDescription: 2-Pin Surface Mount Device, Body 0.6 x 0.3 mm; Packaging: Tape and Reel; PartNumber: GRM033R60J104KE19D; RoHSCompliant: true; Tolerance: 10%; Width: 0.3 mm; Height: 0.3 mm; Mount: Surface Mount; PackageReference: 0201; Pins: 2; Radiation Hardening: No; REACH SVHC: No SVHC
C181 = E22: Chip Capacitor, 100 nF, +/- 10%, 6.3 V, -55 to 85 degC, 0201 (0603 Metric), RoHS, Tape and Reel; Manufacturer: Basic Passives; Тип элемента: Конденсатор; Capacitance: 100 nF; Case\/Package: 0201; Type (Capacitors): X5R; Voltage Rating: 6.3 V; Voltage Rating (DC): 3 V; Old_des: C217; UID: E22; Component Kind: Standard; Case Code (Imperial): 0201; Case Code (Metric): 0603; ComponentLink1Description: Manufacturer URL; ComponentLink1URL: http://www.murata.com/; ComponentLink2Description: Datasheet; ComponentLink2URL: http://search.murata.co.jp/Ceramy/image/img/A01X/G101/ENG/GRM033R60J104KE19-01.pdf; DatasheetVersion: 03/2016; Length: 0.6 mm; Max Operating Temperature: 85 degC; Min Operating Temperature: -55 degC; Mounting Technology: Surface Mount; Package Quantity: 15000; PackageDescription: 2-Pin Surface Mount Device, Body 0.6 x 0.3 mm; Packaging: Tape and Reel; PartNumber: GRM033R60J104KE19D; RoHSCompliant: true; Tolerance: 10%; Width: 0.3 mm; Height: 0.3 mm; Mount: Surface Mount; PackageReference: 0201; Pins: 2; Radiation Hardening: No; REACH SVHC: No SVHC
C182 = E22: Chip Capacitor, 100 nF, +/- 10%, 6.3 V, -55 to 85 degC, 0201 (0603 Metric), RoHS, Tape and Reel; Manufacturer: Basic Passives; Тип элемента: Конденсатор; Capacitance: 100 nF; Case\/Package: 0201; Type (Capacitors): X5R; Voltage Rating: 6.3 V; Voltage Rating (DC): 3 V; Old_des: C218; UID: E22; Component Kind: Standard; Case Code (Imperial): 0201; Case Code (Metric): 0603; ComponentLink1Description: Manufacturer URL; ComponentLink1URL: http://www.murata.com/; ComponentLink2Description: Datasheet; ComponentLink2URL: http://search.murata.co.jp/Ceramy/image/img/A01X/G101/ENG/GRM033R60J104KE19-01.pdf; DatasheetVersion: 03/2016; Length: 0.6 mm; Max Operating Temperature: 85 degC; Min Operating Temperature: -55 degC; Mounting Technology: Surface Mount; Package Quantity: 15000; PackageDescription: 2-Pin Surface Mount Device, Body 0.6 x 0.3 mm; Packaging: Tape and Reel; PartNumber: GRM033R60J104KE19D; RoHSCompliant: true; Tolerance: 10%; Width: 0.3 mm; Height: 0.3 mm; Mount: Surface Mount; PackageReference: 0201; Pins: 2; Radiation Hardening: No; REACH SVHC: No SVHC
C183 = E22: Chip Capacitor, 100 nF, +/- 10%, 6.3 V, -55 to 85 degC, 0201 (0603 Metric), RoHS, Tape and Reel; Manufacturer: Basic Passives; Тип элемента: Конденсатор; Capacitance: 100 nF; Case\/Package: 0201; Type (Capacitors): X5R; Voltage Rating: 6.3 V; Voltage Rating (DC): 3 V; Old_des: C219; UID: E22; Component Kind: Standard; Case Code (Imperial): 0201; Case Code (Metric): 0603; ComponentLink1Description: Manufacturer URL; ComponentLink1URL: http://www.murata.com/; ComponentLink2Description: Datasheet; ComponentLink2URL: http://search.murata.co.jp/Ceramy/image/img/A01X/G101/ENG/GRM033R60J104KE19-01.pdf; DatasheetVersion: 03/2016; Length: 0.6 mm; Max Operating Temperature: 85 degC; Min Operating Temperature: -55 degC; Mounting Technology: Surface Mount; Package Quantity: 15000; PackageDescription: 2-Pin Surface Mount Device, Body 0.6 x 0.3 mm; Packaging: Tape and Reel; PartNumber: GRM033R60J104KE19D; RoHSCompliant: true; Tolerance: 10%; Width: 0.3 mm; Height: 0.3 mm; Mount: Surface Mount; PackageReference: 0201; Pins: 2; Radiation Hardening: No; REACH SVHC: No SVHC
C184 = E22: Chip Capacitor, 100 nF, +/- 10%, 6.3 V, -55 to 85 degC, 0201 (0603 Metric), RoHS, Tape and Reel; Manufacturer: Basic Passives; Тип элемента: Конденсатор; Capacitance: 100 nF; Case\/Package: 0201; Type (Capacitors): X5R; Voltage Rating: 6.3 V; Voltage Rating (DC): 3 V; Old_des: C220; UID: E22; Component Kind: Standard; Case Code (Imperial): 0201; Case Code (Metric): 0603; ComponentLink1Description: Manufacturer URL; ComponentLink1URL: http://www.murata.com/; ComponentLink2Description: Datasheet; ComponentLink2URL: http://search.murata.co.jp/Ceramy/image/img/A01X/G101/ENG/GRM033R60J104KE19-01.pdf; DatasheetVersion: 03/2016; Length: 0.6 mm; Max Operating Temperature: 85 degC; Min Operating Temperature: -55 degC; Mounting Technology: Surface Mount; Package Quantity: 15000; PackageDescription: 2-Pin Surface Mount Device, Body 0.6 x 0.3 mm; Packaging: Tape and Reel; PartNumber: GRM033R60J104KE19D; RoHSCompliant: true; Tolerance: 10%; Width: 0.3 mm; Height: 0.3 mm; Mount: Surface Mount; PackageReference: 0201; Pins: 2; Radiation Hardening: No; REACH SVHC: No SVHC
C185 = E22: Chip Capacitor, 100 nF, +/- 10%, 6.3 V, -55 to 85 degC, 0201 (0603 Metric), RoHS, Tape and Reel; Manufacturer: Basic Passives; Тип элемента: Конденсатор; Capacitance: 100 nF; Case\/Package: 0201; Type (Capacitors): X5R; Voltage Rating: 6.3 V; Voltage Rating (DC): 3 V; Old_des: C221; UID: E22; Component Kind: Standard; Case Code (Imperial): 0201; Case Code (Metric): 0603; ComponentLink1Description: Manufacturer URL; ComponentLink1URL: http://www.murata.com/; ComponentLink2Description: Datasheet; ComponentLink2URL: http://search.murata.co.jp/Ceramy/image/img/A01X/G101/ENG/GRM033R60J104KE19-01.pdf; DatasheetVersion: 03/2016; Length: 0.6 mm; Max Operating Temperature: 85 degC; Min Operating Temperature: -55 degC; Mounting Technology: Surface Mount; Package Quantity: 15000; PackageDescription: 2-Pin Surface Mount Device, Body 0.6 x 0.3 mm; Packaging: Tape and Reel; PartNumber: GRM033R60J104KE19D; RoHSCompliant: true; Tolerance: 10%; Width: 0.3 mm; Height: 0.3 mm; Mount: Surface Mount; PackageReference: 0201; Pins: 2; Radiation Hardening: No; REACH SVHC: No SVHC
C186 = E22: Chip Capacitor, 100 nF, +/- 10%, 6.3 V, -55 to 85 degC, 0201 (0603 Metric), RoHS, Tape and Reel; Manufacturer: Basic Passives; Тип элемента: Конденсатор; Capacitance: 100 nF; Case\/Package: 0201; Type (Capacitors): X5R; Voltage Rating: 6.3 V; Voltage Rating (DC): 3 V; Old_des: C222; UID: E22; Component Kind: Standard; Case Code (Imperial): 0201; Case Code (Metric): 0603; ComponentLink1Description: Manufacturer URL; ComponentLink1URL: http://www.murata.com/; ComponentLink2Description: Datasheet; ComponentLink2URL: http://search.murata.co.jp/Ceramy/image/img/A01X/G101/ENG/GRM033R60J104KE19-01.pdf; DatasheetVersion: 03/2016; Length: 0.6 mm; Max Operating Temperature: 85 degC; Min Operating Temperature: -55 degC; Mounting Technology: Surface Mount; Package Quantity: 15000; PackageDescription: 2-Pin Surface Mount Device, Body 0.6 x 0.3 mm; Packaging: Tape and Reel; PartNumber: GRM033R60J104KE19D; RoHSCompliant: true; Tolerance: 10%; Width: 0.3 mm; Height: 0.3 mm; Mount: Surface Mount; PackageReference: 0201; Pins: 2; Radiation Hardening: No; REACH SVHC: No SVHC
C187 = E22: Chip Capacitor, 100 nF, +/- 10%, 6.3 V, -55 to 85 degC, 0201 (0603 Metric), RoHS, Tape and Reel; Manufacturer: Basic Passives; Тип элемента: Конденсатор; Capacitance: 100 nF; Case\/Package: 0201; Type (Capacitors): X5R; Voltage Rating: 6.3 V; Voltage Rating (DC): 3 V; Old_des: C223; UID: E22; Component Kind: Standard; Case Code (Imperial): 0201; Case Code (Metric): 0603; ComponentLink1Description: Manufacturer URL; ComponentLink1URL: http://www.murata.com/; ComponentLink2Description: Datasheet; ComponentLink2URL: http://search.murata.co.jp/Ceramy/image/img/A01X/G101/ENG/GRM033R60J104KE19-01.pdf; DatasheetVersion: 03/2016; Length: 0.6 mm; Max Operating Temperature: 85 degC; Min Operating Temperature: -55 degC; Mounting Technology: Surface Mount; Package Quantity: 15000; PackageDescription: 2-Pin Surface Mount Device, Body 0.6 x 0.3 mm; Packaging: Tape and Reel; PartNumber: GRM033R60J104KE19D; RoHSCompliant: true; Tolerance: 10%; Width: 0.3 mm; Height: 0.3 mm; Mount: Surface Mount; PackageReference: 0201; Pins: 2; Radiation Hardening: No; REACH SVHC: No SVHC
C188 = E14: Chip Capacitor, 100 uF, +/- 20%, 6.3 V, -55 to 85 degC, 1206 (3216 Metric), RoHS, Tape and Reel; Тип элемента: Конденсатор; Capacitance: 100 uF; Case\/Package: 1206; Type (Capacitors): X5R; Voltage Rating: 6.3 V; Old_des: C139; New_des: C180; UID: E14; Component Kind: Standard; Case Code (Imperial): 1206; Case Code (Metric): 3216; ComponentLink1Description: Manufacturer URL; ComponentLink1URL: http://www.murata.com/; ComponentLink2Description: Datasheet; ComponentLink2URL: http://psearch.en.murata.com/capacitor/product/GRM31CR60J107ME39%23.pdf; DatasheetVersion: 09/2016; Length: 3.2 mm; Max Operating Temperature: 85 degC; Min Operating Temperature: -55 degC; Mounting Technology: Surface Mount; Package Quantity: 2000; PackageDescription: 2-Pin Surface Mount Device, Body 3.2 x 1.6 mm; Packaging: Tape and Reel; PartNumber: GRM31CR60J107ME39L; RoHSCompliant: true; Tolerance: 20%; Width: 1.6 mm; Height: 1.6 mm; Mount: Surface Mount; PackageReference: 1206; Pins: 2; Radiation Hardening: No; REACH SVHC: No SVHC; Voltage Rating (DC): 6.3 V
C189 = E14: Chip Capacitor, 100 uF, +/- 20%, 6.3 V, -55 to 85 degC, 1206 (3216 Metric), RoHS, Tape and Reel; Тип элемента: Конденсатор; Capacitance: 100 uF; Case\/Package: 1206; Type (Capacitors): X5R; Voltage Rating: 6.3 V; Old_des: C152; New_des: C181; UID: E14; Component Kind: Standard; Case Code (Imperial): 1206; Case Code (Metric): 3216; ComponentLink1Description: Manufacturer URL; ComponentLink1URL: http://www.murata.com/; ComponentLink2Description: Datasheet; ComponentLink2URL: http://psearch.en.murata.com/capacitor/product/GRM31CR60J107ME39%23.pdf; DatasheetVersion: 09/2016; Length: 3.2 mm; Max Operating Temperature: 85 degC; Min Operating Temperature: -55 degC; Mounting Technology: Surface Mount; Package Quantity: 2000; PackageDescription: 2-Pin Surface Mount Device, Body 3.2 x 1.6 mm; Packaging: Tape and Reel; PartNumber: GRM31CR60J107ME39L; RoHSCompliant: true; Tolerance: 20%; Width: 1.6 mm; Height: 1.6 mm; Mount: Surface Mount; PackageReference: 1206; Pins: 2; Radiation Hardening: No; REACH SVHC: No SVHC; Voltage Rating (DC): 6.3 V